# Altium schematic sheet FPGA_PinMapping.SchDoc
size 203 x 203 mm; SheetNumber: 1; SheetTotal: 5
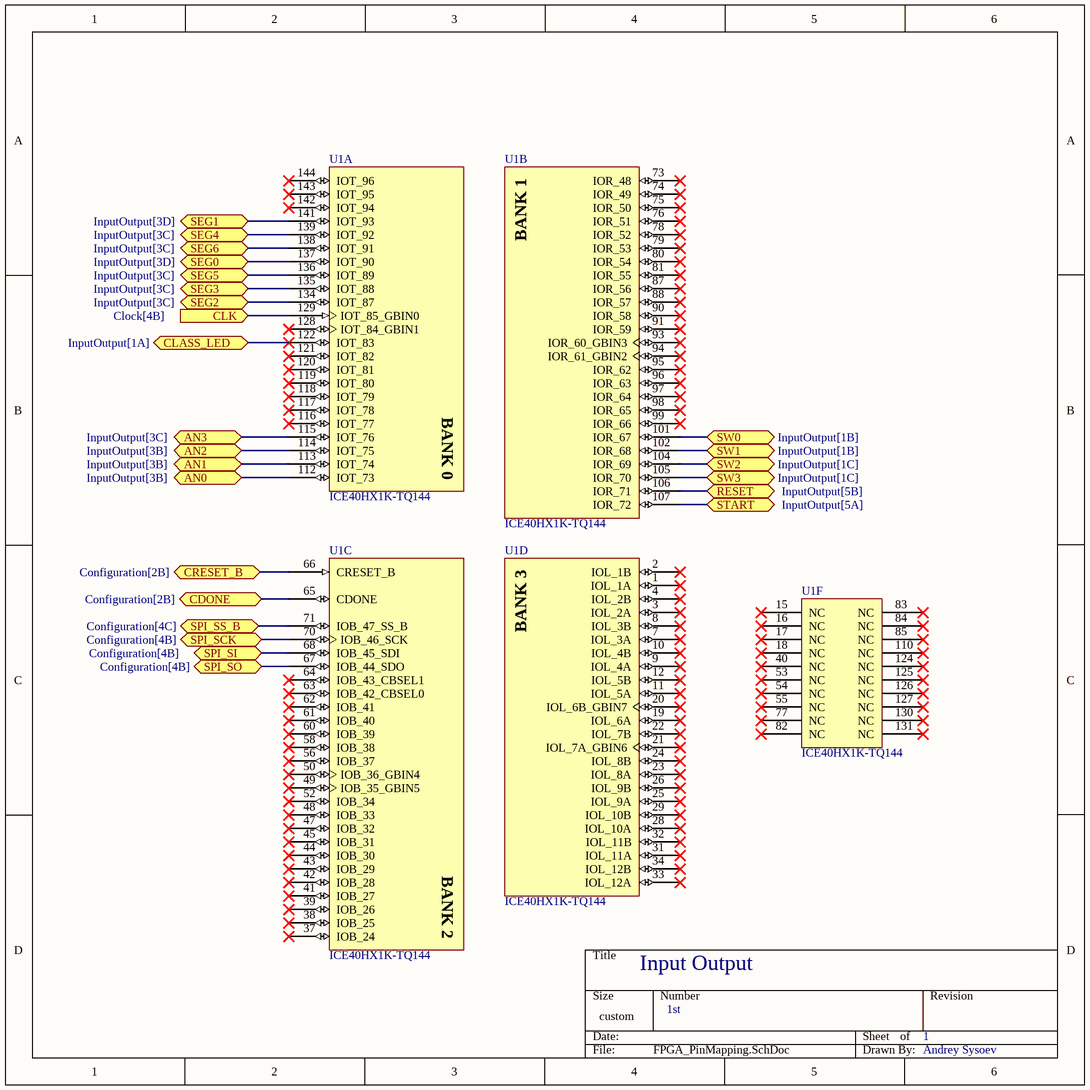
[diagram p0: FPGA_PinMapping.SchDoc]

## Parts
U1  ICE40HX1K-TQ144  [LATC-TQFP-144_N]  (parts A,B,C,D,F of 6)

## Ports
AN0 (bidir, see InputOutput[3B]), AN1 (bidir, see InputOutput[3B]), AN2 (bidir, see InputOutput[3B]), AN3 (bidir, see InputOutput[3C]), CDONE (bidir, see Configuration[2B]), CLASS_LED (bidir, see InputOutput[1A]), CLK (in, see Clock[4B]), CRESET_B (bidir, see Configuration[2B]), RESET (bidir, see InputOutput[5B]), SEG0 (bidir, see InputOutput[3D]), SEG1 (bidir, see InputOutput[3D]), SEG2 (bidir, see InputOutput[3C]), SEG3 (bidir, see InputOutput[3C]), SEG4 (bidir, see InputOutput[3C]), SEG5 (bidir, see InputOutput[3C]), SEG6 (bidir, see InputOutput[3C]), SPI_SCK (bidir, see Configuration[4B]), SPI_SI (bidir, see Configuration[4B]), SPI_SO (bidir, see Configuration[4B]), SPI_SS_B (bidir, see Configuration[4C]), START (bidir, see InputOutput[5A]), SW0 (bidir, see InputOutput[1B]), SW1 (bidir, see InputOutput[1B]), SW2 (bidir, see InputOutput[1C]), SW3 (bidir, see InputOutput[1C])

## Nets
AN0: U1.112(IOT_73) ; port AN0
AN1: U1.113(IOT_74) ; port AN1
AN2: U1.114(IOT_75) ; port AN2
AN3: U1.115(IOT_76) ; port AN3
CDONE: U1.65(CDONE) ; port CDONE
CLASS_LED: U1.122(IOT_83) ; port CLASS_LED
CLK: U1.129(IOT_85_GBIN0) ; port CLK
CRESET_B: U1.66(CRESET_B) ; port CRESET_B
RESET: U1.106(IOR_71) ; port RESET
SEG0: U1.137(IOT_90) ; port SEG0
SEG1: U1.141(IOT_93) ; port SEG1
SEG2: U1.134(IOT_87) ; port SEG2
SEG3: U1.135(IOT_88) ; port SEG3
SEG4: U1.139(IOT_92) ; port SEG4
SEG5: U1.136(IOT_89) ; port SEG5
SEG6: U1.138(IOT_91) ; port SEG6
SPI_SCK: U1.70(IOB_46_SCK) ; port SPI_SCK
SPI_SI: U1.68(IOB_45_SDI) ; port SPI_SI
SPI_SO: U1.67(IOB_44_SDO) ; port SPI_SO
SPI_SS_B: U1.71(IOB_47_SS_B) ; port SPI_SS_B
START: U1.107(IOR_72) ; port START
SW0: U1.101(IOR_67) ; port SW0
SW1: U1.102(IOR_68) ; port SW1
SW2: U1.104(IOR_69) ; port SW2
SW3: U1.105(IOR_70) ; port SW3

Not connected (* = marked no-connect by the designer): U1 1(IOL_1A)* 2(IOL_1B)* 3(IOL_2A)* 4(IOL_2B)* 7(IOL_3A)* 8(IOL_3B)* 9(IOL_4A)* 10(IOL_4B)* 11(IOL_5A)* 12(IOL_5B)* 15(NC)* 16(NC)* 17(NC)* 18(NC)* 19(IOL_6A)* 20(IOL_6B_GBIN7)* 21(IOL_7A_GBIN6)* 22(IOL_7B)* 23(IOL_8A)* 24(IOL_8B)* 25(IOL_9A)* 26(IOL_9B)* 28(IOL_10A)* 29(IOL_10B)* 31(IOL_11A)* 32(IOL_11B)* 33(IOL_12A)* 34(IOL_12B)* 37(IOB_24)* 38(IOB_25)* 39(IOB_26)* 40(NC)* 41(IOB_27)* 42(IOB_28)* 43(IOB_29)* 44(IOB_30)* 45(IOB_31)* 47(IOB_32)* 48(IOB_33)* 49(IOB_35_GBIN5)* 50(IOB_36_GBIN4)* 52(IOB_34)* 53(NC)* 54(NC)* 55(NC)* 56(IOB_37)* 58(IOB_38)* 60(IOB_39)* 61(IOB_40)* 62(IOB_41)* 63(IOB_42_CBSEL0)* 64(IOB_43_CBSEL1)* 73(IOR_48)* 74(IOR_49)* 75(IOR_50)* 76(IOR_51)* 77(NC)* 78(IOR_52)* 79(IOR_53)* 80(IOR_54)* 81(IOR_55)* 82(NC)* 83(NC)* 84(NC)* 85(NC)* 87(IOR_56)* 88(IOR_57)* 90(IOR_58)* 91(IOR_59)* 93(IOR_60_GBIN3)* 94(IOR_61_GBIN2)* 95(IOR_62)* 96(IOR_63)* 97(IOR_64)* 98(IOR_65)* 99(IOR_66)* 110(NC)* 116(IOT_77)* 117(IOT_78)* 118(IOT_79)* 119(IOT_80)* 120(IOT_81)* 121(IOT_82)* 124(NC)* 125(NC)* 126(NC)* 127(NC)* 128(IOT_84_GBIN1)* 130(NC)* 131(NC)* 142(IOT_94)* 143(IOT_95)* 144(IOT_96)*

## Notes on the sheet
- Input Output
- 1st
- 1
- Andrey Sysoev
- (in symbol CMP-031-00018-1, part A) BANK 0
- (in symbol CMP-031-00018-1, part B) BANK 1
- (in symbol CMP-031-00018-1, part C) BANK 2
- (in symbol CMP-031-00018-1, part D) BANK 3

## Library data of the parts
U1 = CMP-031-00018-1: FPGA iCE40 HX Family 1280 Cells 40nm Technology 1.2V 144-Pin TQFP Tray; Max Supply Voltage: 1.26V; Min Supply Voltage: 1.14V; Pins: 144; Case/Package: LFQFP; Max Operating Temperature: 85°C; Min Operating Temperature: -40°C